# Altium project FROGSBORO.PrjPcb (part 1 of 2)
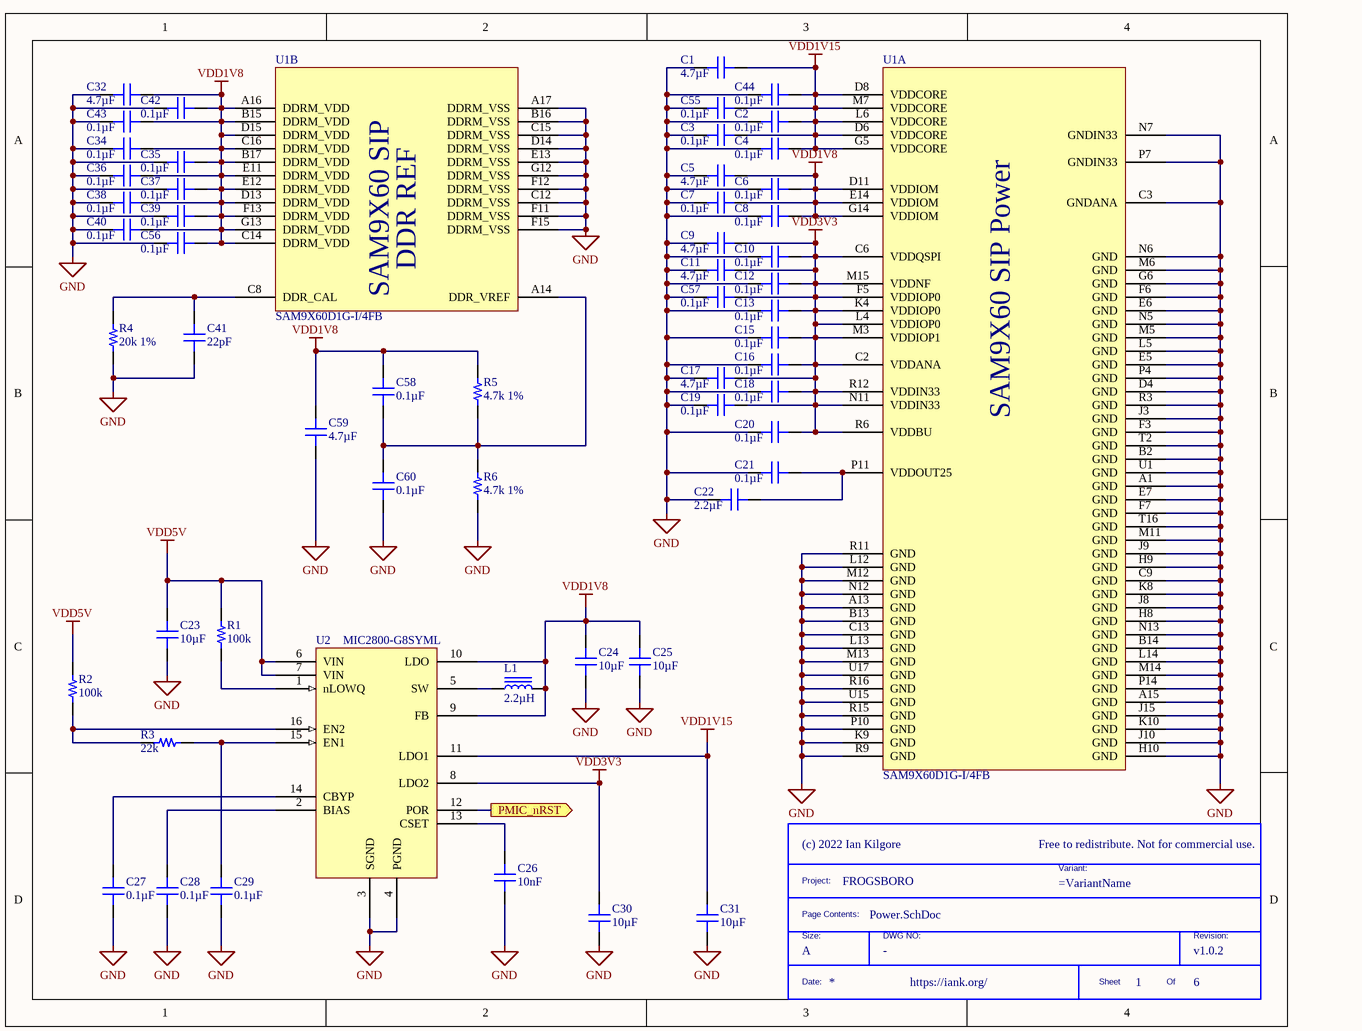
[diagram p0: Power.SchDoc]
VersionRevision: v1.0.2; DesignedByURL: https://iank.org/; Project: FROGSBORO; Company: (c) 2022 Ian Kilgore
6 sheets, 122 parts. Net scope: flat (ports and power ports of the same name join across sheets).
Board file: FROGSBORO.PcbDoc
Sheets:
  Power.SchDoc
  SAM9X60_Core.SchDoc
  SAM9X60_IO.SchDoc
  USB.SchDoc
  SD.SchDoc
  Connectors.SchDoc

## Sheet Power.SchDoc
size A; DocumentNumber: 1; SheetNumber: 1; SheetTotal: 6

### Parts
(Parts that share a designator on the sheet are numbered #1, #2 ... from top to bottom, then left to right.)
*#1  Size: A  (hidden comment: TitleBlock)  (graphical)
C1  4.7µF  [CAP 0402_1005]
C2  0.1µF  [CAP 0402_1005]
C3  0.1µF  [CAP 0402_1005]
C4  0.1µF  [CAP 0402_1005]
C5  4.7µF  [CAP 0402_1005]
C6  0.1µF  [CAP 0402_1005]
C7  0.1µF  [CAP 0402_1005]
C8  0.1µF  [CAP 0402_1005]
C9  4.7µF  [CAP 0402_1005]
C10  0.1µF  [CAP 0402_1005]
C11  4.7µF  [CAP 0402_1005]
C12  0.1µF  [CAP 0402_1005]
C13  0.1µF  [CAP 0402_1005]
C15  0.1µF  [CAP 0402_1005]
C16  0.1µF  [CAP 0402_1005]
C17  4.7µF  [CAP 0402_1005]
C18  0.1µF  [CAP 0402_1005]
C19  0.1µF  [CAP 0402_1005]
C20  0.1µF  [CAP 0402_1005]
C21  0.1µF  [CAP 0402_1005]
C22  2.2µF  [CAP 0402_1005]
C23  10µF  [CAP 0805_2012]
C24  10µF  [CAP 0805_2012]
C25  10µF  [CAP 0805_2012]
C26  10nF  [CAP 0402_1005]
C27  0.1µF  [CAP 0402_1005]
C28  0.1µF  [CAP 0402_1005]
C29  0.1µF  [CAP 0402_1005]
C30  10µF  [CAP 0805_2012]
C31  10µF  [CAP 0805_2012]
C32  4.7µF  [CAP 0402_1005]
C34  0.1µF  [CAP 0402_1005]
C35  0.1µF  [CAP 0402_1005]
C36  0.1µF  [CAP 0402_1005]
C37  0.1µF  [CAP 0402_1005]
C38  0.1µF  [CAP 0402_1005]
C39  0.1µF  [CAP 0402_1005]
C40  0.1µF  [CAP 0402_1005]
C41  22pF  [CAP 0402_1005]
C42  0.1µF  [CAP 0402_1005]
C43  0.1µF  [CAP 0402_1005]
C44  0.1µF  [CAP 0402_1005]
C55  0.1µF  [CAP 0402_1005]
C56  0.1µF  [CAP 0402_1005]
C57  0.1µF  [CAP 0402_1005]
C58  0.1µF  [CAP 0402_1005]
C59  4.7µF  [CAP 0402_1005]
C60  0.1µF  [CAP 0402_1005]
L1  2.2µH  [IND 0806_2016]
R1  100k  [RES 0402_1005]
R2  100k  [RES 0402_1005]
R3  22k  [RES 0402_1005]
R4  20k 1%  [RES 0402_1005]
R5  4.7k 1%  [RES 0402_1005]
R6  4.7k 1%  [RES 0402_1005]
U1  SAM9X60D1G-I/4FB  [BGA233C80P17X17_1400X1400X120]  (parts A,B of 7)
U2  MIC2800-G8SYML  [QFN50P300X300X90-16N]

### Ports
PMIC_nRST (out)

### Nets
GND: C1.1 C2.2 C3.2 C4.2 C5.1 C6.2 C7.2 C8.2 C9.1 C10.2 C11.1 C12.2 C13.2 C15.2 C16.2 C17.1 C18.2 C19.2 C20.2 C21.2 C22.2 C23.1 C24.1 C25.1 C26.1 C27.1 C28.1 C29.1 C30.1 C31.1 C32.1 C34.2 C35.2 C36.2 C37.2 C38.2 C39.2 C40.2 C41.1 C42.2 C43.2 C44.2 C55.2 C56.2 C57.2 C59.1 C60.2 R4.1 R6.1 U1.A1(GND) U1.A13(GND) U1.A15(GND) U1.A17(DDRM_VSS) U1.B2(GND) U1.B13(GND) U1.B14(GND) U1.B16(DDRM_VSS) U1.C3(GNDANA) U1.C9(GND) U1.C12(DDRM_VSS) U1.C13(GND) U1.C15(DDRM_VSS) U1.D4(GND) U1.D14(DDRM_VSS) U1.E5(GND) U1.E6(GND) U1.E7(GND) U1.E13(DDRM_VSS) U1.F3(GND) U1.F6(GND) U1.F7(GND) U1.F11(DDRM_VSS) U1.F12(DDRM_VSS) U1.F15(DDRM_VSS) U1.G6(GND) U1.G12(DDRM_VSS) U1.H8(GND) U1.H9(GND) U1.H10(GND) U1.J3(GND) U1.J8(GND) U1.J9(GND) U1.J10(GND) U1.J15(GND) U1.K8(GND) U1.K9(GND) U1.K10(GND) U1.L5(GND) U1.L12(GND) U1.L13(GND) U1.L14(GND) U1.M5(GND) U1.M6(GND) U1.M11(GND) U1.M12(GND) U1.M13(GND) U1.M14(GND) U1.N5(GND) U1.N6(GND) U1.N7(GNDIN33) U1.N12(GND) U1.N13(GND) U1.P4(GND) U1.P7(GNDIN33) U1.P10(GND) U1.P14(GND) U1.R3(GND) U1.R9(GND) U1.R11(GND) U1.R15(GND) U1.R16(GND) U1.T2(GND) U1.T16(GND) U1.U1(GND) U1.U15(GND) U1.U17(GND) U2.3(SGND) U2.4(PGND)
VDD1V8: C5.2 C6.1 C7.1 C8.1 C24.2 C25.2 C32.2 C34.1 C35.1 C36.1 C37.1 C38.1 C39.1 C40.1 C42.1 C43.1 C56.1 C58.1 C59.2 L1.2 R5.2 U1.A16(DDRM_VDD) U1.B15(DDRM_VDD) U1.B17(DDRM_VDD) U1.C14(DDRM_VDD) U1.C16(DDRM_VDD) U1.D11(VDDIOM) U1.D13(DDRM_VDD) U1.D15(DDRM_VDD) U1.E11(DDRM_VDD) U1.E12(DDRM_VDD) U1.E14(VDDIOM) U1.F13(DDRM_VDD) U1.G13(DDRM_VDD) U1.G14(VDDIOM) U2.9(FB) U2.10(LDO)
VDD1V15: C1.2 C2.1 C3.1 C4.1 C31.2 C44.1 C55.1 U1.D6(VDDCORE) U1.D8(VDDCORE) U1.G5(VDDCORE) U1.L6(VDDCORE) U1.M7(VDDCORE) U2.11(LDO1)
VDD3V3: C9.2 C10.1 C11.2 C12.1 C13.1 C15.1 C16.1 C17.2 C18.1 C19.1 C20.1 C30.2 C57.1 U1.C2(VDDANA) U1.C6(VDDQSPI) U1.F5(VDDIOP0) U1.K4(VDDIOP0) U1.L4(VDDIOP0) U1.M3(VDDIOP1) U1.M15(VDDNF) U1.N11(VDDIN33) U1.R6(VDDBU) U1.R12(VDDIN33) U2.8(LDO2)
VDD5V: C23.2 R1.2 R2.2 U2.6(VIN) U2.7(VIN)
NetC21_1: C21.1 C22.1 U1.P11(VDDOUT25)
NetC26_2: C26.2 U2.13(CSET)
NetC27_2: C27.2 U2.14(CBYP)
NetC28_2: C28.2 U2.2(BIAS)
NetC29_2: C29.2 R3.1 U2.15(EN1)
NetC41_2: C41.2 R4.2 U1.C8(DDR_CAL)
NetC58_2: C58.2 C60.1 R5.1 R6.2 U1.A14(DDR_VREF)
NetL1_1: L1.1 U2.5(SW)
NetR1_1: R1.1 U2.1(nLOWQ)
NetR2_1: R2.1 R3.2 U2.16(EN2)
NetR15_1: U2.12(POR) ; port PMIC_nRST

### Notes on the sheet
- (in symbol SAM9X60D1G-I/4FB, part A) SAM9X60 SIP Power
- (in symbol SAM9X60D1G-I/4FB, part B) DDR REF; SAM9X60 SIP
- (in symbol TitleBlock) Free to redistribute. Not for commercial use.; Project:; Variant:; Page Contents:; Size:; DWG NO:; Revision:; Date:; Sheet; Of

### Library data of the parts
*#1 = TitleBlock: Custom Title Block; DWG: -
C1 C5 C9 C11 C17 C32 C59 = CL05A475KP5NRNC: CAP CER 4.7UF 10V X5R 0402; Manufacturer: Samsung Electro-Mechanics; Tolerance: ±10%; Part Number: CL05A475KP5NRNC; Value: 4.7µF; Applications: General Purpose; Capacitance: 4.7µF; ComponentLink1Description: Datasheet; ComponentLink1URL: http://www.samsungsem.com/kr/support/product-search/mlcc/CL05A475KP5NRNC.jsp; ComponentLink2Description: DigiKey Link; ComponentLink2URL: http://digikey.com/product-detail/en/samsung-electro-mechanics/CL05A475KP5NRNC/1276-1480-1-ND/3889566; Device Package: 0402 (1005 Metric); LastUpdated: 9/2/2020 1:02:23 AM; Lifecycle Status: Active; Minimum Order: 1; Mounting Type: Surface Mount, MLCC; Operating Temperature: -55°C ~ 85°C; Package / Case: 0402 (1005 Metric); Packaging: TapeAndReel; PartId: 2191; Part Status: Active; Price: 0.08; Series: CL; Size / Dimension: 0.039" L x 0.020" W (1.00mm x 0.50mm); Supplier 1: DigiKey; Supplier Part Number 1: 1276-1480-1-ND; Temperature Coefficient: X5R; Thickness (Max): 0.022" (0.55mm); Voltage - Rated: 10V
C2-C4 C6-C8 C10 C12 C13 C15 C16 C18-C21 C27-C29 C34-C40 C42-C44 C55-C58 C60 = C0402C104K4PACTU: CAP CER 0.1UF 16V X5R 0402; Manufacturer: KEMET; Tolerance: ±10%; Part Number: C0402C104K4PACTU; Value: 0.1µF; Applications: General Purpose; Capacitance: 0.1µF; ComponentLink1Description: Datasheet; ComponentLink1URL: https://api.kemet.com/component-edge/download/datasheet/C0402C104K4PACTU.pdf; ComponentLink2Description: DigiKey Link; ComponentLink2URL: http://digikey.com/product-detail/en/kemet/C0402C104K4PACTU/399-7762-1-ND/3471485; Device Package: 0402 (1005 Metric); LastUpdated: 9/2/2020 1:02:03 AM; Lifecycle Status: Active; Minimum Order: 1; Mounting Type: Surface Mount, MLCC; Operating Temperature: -55°C ~ 85°C; Package / Case: 0402 (1005 Metric); Packaging: TapeAndReel; PartId: 11334; Part Status: Active; Price: 0.01; Series: SMD Comm X5R; Size / Dimension: 0.039" L x 0.020" W (1.00mm x 0.50mm); Supplier 1: DigiKey; Supplier Part Number 1: 399-7762-1-ND; Temperature Coefficient: X5R; Thickness (Max): 0.022" (0.55mm); Voltage - Rated: 16V
C22 = C1005X5R1A225K050BC: CAP CER 2.2UF 10V X5R 0402; Manufacturer: TDK Corporation; Tolerance: ±10%; Part Number: C1005X5R1A225K050BC; Value: 2.2µF; Applications: General Purpose; Capacitance: 2.2µF; ComponentLink1Description: Datasheet; ComponentLink1URL: https://product.tdk.com/info/en/catalog/datasheets/mlcc_commercial_general_en.pdf?ref_disty=digikey; ComponentLink2Description: DigiKey Link; ComponentLink2URL: http://digikey.com/product-detail/en/tdk-corporation/C1005X5R1A225K050BC/445-7392-1-ND/2733464; Device Package: 0402 (1005 Metric); Features: Low ESL; LastUpdated: 9/2/2020 1:02:23 AM; Lifecycle Status: Active; Minimum Order: 1; Mounting Type: Surface Mount, MLCC; Operating Temperature: -55°C ~ 85°C; Package / Case: 0402 (1005 Metric); Packaging: TapeAndReel; PartId: 2144; Part Status: Active; Price: 0.07; Series: C; Size / Dimension: 0.039" L x 0.020" W (1.00mm x 0.50mm); Supplier 1: DigiKey; Supplier Part Number 1: 445-7392-1-ND; Temperature Coefficient: X5R; Thickness (Max): 0.022" (0.55mm); Voltage - Rated: 10V
C23-C25 C30 C31 = CL21A106KPCLQNC: CAP CER 10UF 10V X5R 0805; Manufacturer: Samsung Electro-Mechanics; Tolerance: ±10%; Part Number: CL21A106KPCLQNC; Value: 10µF; Applications: General Purpose; Capacitance: 10µF; ComponentLink1Description: Datasheet; ComponentLink1URL: http://www.samsungsem.com/kr/support/product-search/mlcc/CL21A106KPCLQNC.jsp; ComponentLink2Description: DigiKey Link; ComponentLink2URL: http://digikey.com/product-detail/en/samsung-electro-mechanics/CL21A106KPCLQNC/1276-2402-1-ND/3890488; Device Package: 0805 (2012 Metric); LastUpdated: 9/2/2020 1:04:19 AM; Lifecycle Status: Active; Minimum Order: 1; Mounting Type: Surface Mount, MLCC; Operating Temperature: -55°C ~ 85°C; Package / Case: 0805 (2012 Metric); Packaging: TapeAndReel; PartId: 14319; Part Status: Active; Price: 0.03; Series: CL; Size / Dimension: 0.079" L x 0.049" W (2.00mm x 1.25mm); Supplier 1: DigiKey; Supplier Part Number 1: 1276-2402-1-ND; Temperature Coefficient: X5R; Thickness (Max): 0.037" (0.95mm); Voltage - Rated: 10V
C26 = C0402C103K4RECAUTO: CAP CER 0402 10NF 16V X7R 10%; Manufacturer: KEMET; Capacitance: 10000pF; Part Number: C0402C103K4RECAUTO; Value: 10nF; Applications: Automotive, ESD Protection; ComponentLink1Description: Datasheet; ComponentLink1URL: https://api.kemet.com/component-edge/download/datasheet/C0402C103K4RECAUTO.pdf; ComponentLink2Description: DigiKey Link; ComponentLink2URL: http://digikey.com/product-detail/en/kemet/C0402C103K4RECAUTO/399-17876-1-ND/8640543; Device Package: 0402 (1005 Metric); LastUpdated: 9/2/2020 1:02:25 AM; Lifecycle Status: Active; Minimum Order: 1; Mounting Type: Surface Mount, MLCC; Operating Temperature: -55°C ~ 125°C; Package / Case: 0402 (1005 Metric); Packaging: TapeAndReel; PartId: 1725; Part Status: Active; Price: 0.02; Ratings: AEC-Q200; Series: ESD SMD Auto X7R; Size / Dimension: 0.039" L x 0.020" W (1.00mm x 0.50mm); Supplier 1: DigiKey; Supplier Part Number 1: 399-17876-1-ND; Temperature Coefficient: X7R; Thickness (Max): 0.022" (0.55mm); Tolerance: ±10%; Voltage - Rated: 16V
C41 = 0402N220F500CT: CAP CER 22PF 50V C0G/NP0 0402; Manufacturer: Walsin Technology Corporation; Temperature Coefficient: C0G, NP0; Tolerance: ±1%; Part Number: 0402N220F500CT; Value: 22pF; Applications: General Purpose; Capacitance: 22pF; ComponentLink1Description: Datasheet; ComponentLink1URL: http://www.passivecomponent.com/wp-content/uploads/2018/10/MLCC.pdf; ComponentLink2Description: DigiKey Link; ComponentLink2URL: http://digikey.com/product-detail/en/walsin-technology-corporation/0402N220F500CT/1292-1280-1-ND/9355284; Device Package: 0402 (1005 Metric); LastUpdated: 9/2/2020 1:02:14 AM; Lifecycle Status: Active; Minimum Order: 1; Mounting Type: Surface Mount, MLCC; Operating Temperature: -55°C ~ 125°C; Package / Case: 0402 (1005 Metric); Packaging: TapeAndReel; PartId: 6200; Part Status: Active; Price: 0.01; Series: -; Size / Dimension: 0.039" L x 0.020" W (1.00mm x 0.50mm); Supplier 1: DigiKey; Supplier Part Number 1: 1292-1280-1-ND; Thickness (Max): 0.022" (0.55mm); Voltage - Rated: 50V
L1 = CIGT201610EH2R2MNE: FIXED IND 2.2UH 2.5A 87MOHM SMD; Manufacturer: Samsung Electro-Mechanics; Current - Saturation: 2.9A; DC Resistance (DCR): 87mOhm Max; Inductance Frequency - Test: 1MHz; Material - Core: Metal Composite; Shielding: Unshielded; Tolerance: ±20%; Type: Thin Film; Part Number: CIGT201610EH2R2MNE; ComponentLink1Description: Datasheet; ComponentLink1URL: http://www.samsungsem.com/kr/support/product-search/inductor/CIGT201610EH2R2MNE.jsp; ComponentLink2Description: DigiKey Link; ComponentLink2URL: http://digikey.com/product-detail/en/samsung-electro-mechanics/CIGT201610EH2R2MNE/1276-6901-1-ND/7041301; Current Rating (Amps): 2.5A; Device Package: 0806 (2016 Metric); Height - Seated (Max): 0.039" (1.00mm); Inductance: 2.2µH; LastUpdated: 9/2/2020 1:24:36 AM; Lifecycle Status: Active; Minimum Order: 1; Mounting Type: Surface Mount; Operating Temperature: -40°C ~ 125°C; Package / Case: 0806 (2016 Metric); Packaging: TapeAndReel; PartId: 3766; Part Status: Active; Price: 0.11; Series: CIGT; Size / Dimension: 0.079" L x 0.063" W (2.00mm x 1.60mm); Supplier 1: DigiKey; Supplier Part Number 1: 1276-6901-1-ND; Supplier Device Package: 0806 (2016 Metric); Value: 2.2µH
R1 R2 = CRCW0402100KFKEDC: RES SMD 100K OHM 1% 1/16W 0402; Manufacturer: Vishay Dale; Power (Watts): 0.063W, 1/16W; Resistance: 100 kOhms; Temperature Coefficient: ±100ppm/°C; Part Number: CRCW0402100KFKEDC; Value: 100k; ComponentLink1Description: Datasheet; ComponentLink1URL: http://www.vishay.com/docs/28773/crcwce3.pdf; ComponentLink2Description: DigiKey Link; ComponentLink2URL: http://digikey.com/product-detail/en/vishay-dale/CRCW0402100KFKEDC/541-3960-1-ND/7928643; Composition: Thick Film; Device Package: 0402 (1005 Metric); Height - Seated (Max): 0.014" (0.35mm); LastUpdated: 9/2/2020 1:07:49 AM; Lifecycle Status: Active; Minimum Order: 1; Number of Terminations: 2; Operating Temperature: -55°C ~ 155°C; Package / Case: 0402 (1005 Metric); Packaging: CutTape; PartId: 12665; Part Status: Active; Price: 0.10; Series: CRCW-C; Size / Dimension: 0.039" L x 0.020" W (1.00mm x 0.50mm); Supplier 1: DigiKey; Supplier Part Number 1: 541-3960-1-ND; Supplier Device Package: 0402; Tolerance: ±1%
R3 = CR0402-FX-2202GLF: RES SMD 22K OHM 1% 1/16W 0402; Manufacturer: Bourns Inc.; Power (Watts): 0.063W, 1/16W; Resistance: 22 kOhms; Temperature Coefficient: ±100ppm/°C; Part Number: CR0402-FX-2202GLF; Value: 22k; ComponentLink1Description: Datasheet; ComponentLink1URL: https://www.bourns.com/docs/Product-Datasheets/CR0402.pdf; ComponentLink2Description: DigiKey Link; ComponentLink2URL: http://digikey.com/product-detail/en/bourns-inc/CR0402-FX-2202GLF/CR0402-FX-2202GLFCT-ND/4247665; Composition: Thick Film; Device Package: 0402 (1005 Metric); Height - Seated (Max): 0.016" (0.40mm); LastUpdated: 9/2/2020 1:08:01 AM; Lifecycle Status: Active; Minimum Order: 1; Number of Terminations: 2; Operating Temperature: -55°C ~ 155°C; Package / Case: 0402 (1005 Metric); Packaging: CutTape; PartId: 6638; Part Status: Active; Price: 0.10; Series: CR0402; Size / Dimension: 0.039" L x 0.020" W (1.00mm x 0.50mm); Supplier 1: DigiKey; Supplier Part Number 1: CR0402-FX-2202GLFCT-ND; Supplier Device Package: 0402; Tolerance: ±1%
R4 = CR0402-FX-2002GLF: RES SMD 20K OHM 1% 1/16W 0402; Manufacturer: Bourns Inc.; Power (Watts): 0.063W, 1/16W; Resistance: 20 kOhms; Temperature Coefficient: ±100ppm/°C; Part Number: CR0402-FX-2002GLF; Value: 20k 1%; ComponentLink1Description: Datasheet; ComponentLink1URL: https://www.bourns.com/docs/Product-Datasheets/CR0402.pdf; ComponentLink2Description: DigiKey Link; ComponentLink2URL: http://digikey.com/product-detail/en/bourns-inc/CR0402-FX-2002GLF/CR0402-FX-2002GLFCT-ND/3740845; Composition: Thick Film; Device Package: 0402 (1005 Metric); Height - Seated (Max): 0.016" (0.40mm); LastUpdated: 9/2/2020 1:08:01 AM; Lifecycle Status: Active; Minimum Order: 1; Number of Terminations: 2; Operating Temperature: -55°C ~ 155°C; Package / Case: 0402 (1005 Metric); Packaging: CutTape; PartId: 6612; Part Status: Active; Price: 0.10; Series: CR0402; Size / Dimension: 0.039" L x 0.020" W (1.00mm x 0.50mm); Supplier 1: DigiKey; Supplier Part Number 1: CR0402-FX-2002GLFCT-ND; Supplier Device Package: 0402; Tolerance: ±1%
R5 R6 = CR0402-FX-4701GLF: RES SMD 4.7K OHM 1% 1/16W 0402; Manufacturer: Bourns Inc.; Power (Watts): 0.063W, 1/16W; Resistance: 4.7 kOhms; Temperature Coefficient: ±100ppm/°C; Part Number: CR0402-FX-4701GLF; Value: 4.7k 1%; ComponentLink1Description: Datasheet; ComponentLink1URL: https://www.bourns.com/docs/Product-Datasheets/CR0402.pdf; ComponentLink2Description: DigiKey Link; ComponentLink2URL: http://digikey.com/product-detail/en/bourns-inc/CR0402-FX-4701GLF/CR0402-FX-4701GLFCT-ND/3740849; Composition: Thick Film; Device Package: 0402 (1005 Metric); Height - Seated (Max): 0.016" (0.40mm); LastUpdated: 9/2/2020 1:08:01 AM; Lifecycle Status: Active; Minimum Order: 1; Number of Terminations: 2; Operating Temperature: -55°C ~ 155°C; Package / Case: 0402 (1005 Metric); Packaging: CutTape; PartId: 6504; Part Status: Active; Price: 0.10; Series: CR0402; Size / Dimension: 0.039" L x 0.020" W (1.00mm x 0.50mm); Supplier 1: DigiKey; Supplier Part Number 1: CR0402-FX-4701GLFCT-ND; Supplier Device Package: 0402; Tolerance: ±1%
U1 = SAM9X60D1G-I/4FB: ARM926 MPU, 1GBIT DDR2, BGA, IND TEMP; Manufacturer: Microchip; Manufacturer Part Number: SAM9X60D6K-I/4GB; Supplier 1: Digi-Key; RoHS: No; Category: Microprocessors; Stock 1: 237; Pricing 1: 1=10.63000, 25=9.74040, 100=8.82060 (USD); Supplier Part Number 1: 150-SAM9X60D6K-I/4GB-ND
U2 = MIC2800-G8SYML-TR: DC-DC + 2 Linear Regulators with LowQ Mode & POR 16 VQFN 3x3x0.90mm T/R RoHS Compliant: Yes; Manufacturer: Microchip; Supplier 1: Digi-Key; Manufacturer Part Number: MIC2800-G8SYML-TR; RoHS: Yes; Category: Power Management ICs; Stock 1: 5000; Pricing 1: 5000=1.90500 (USD); Supplier Part Number 1: MIC2800-G8SYML-TR-ND

## Sheet SAM9X60_Core.SchDoc
size A; DocumentNumber: 2; SheetNumber: 2; SheetTotal: 6
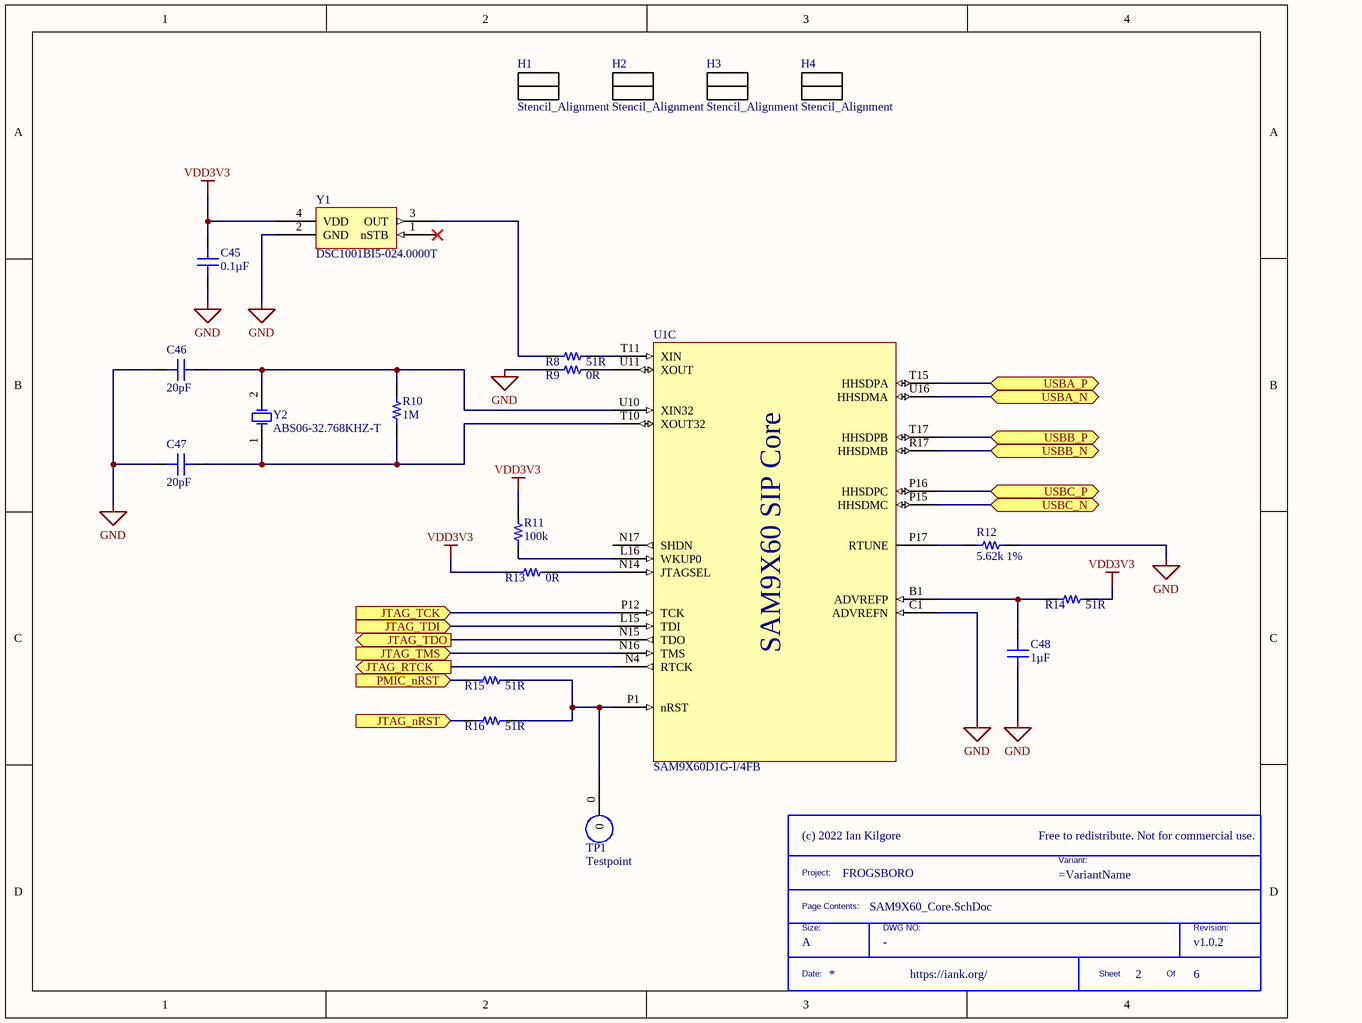
[diagram p1: SAM9X60_Core.SchDoc]

### Parts
(Parts that share a designator on the sheet are numbered #1, #2 ... from top to bottom, then left to right.)
*#2  Size: A  (hidden comment: TitleBlock)  (graphical)
C45  0.1µF  [CAP 0402_1005]
C46  20pF  [CAP 0402_1005]
C47  20pF  [CAP 0402_1005]
C48  1µF  [CAP 0402_1005]
H1  Stencil_Alignment  [Stencil_Alignment]
H2  Stencil_Alignment  [Stencil_Alignment]
H3  Stencil_Alignment  [Stencil_Alignment]
H4  Stencil_Alignment  [Stencil_Alignment]
R8  51R  [RES 0402_1005]
R9  0R  [RES 0402_1005]
R10  1M  [RES 0402_1005]
R11  100k  [RES 0402_1005]
R12  5.62k 1%  [RES 0402_1005]
R13  0R  [RES 0402_1005]
R14  51R  [RES 0402_1005]
R15  51R  [RES 0402_1005]
R16  51R  [RES 0402_1005]
TP1  Testpoint  [Testpoint]  (no BOM)
U1  SAM9X60D1G-I/4FB  [BGA233C80P17X17_1400X1400X120]  (part C of 7)
Y1  DSC1001BI5-024.0000T  [DSC1001BI5]
Y2  ABS06-32.768KHZ-T  [ABRA-ABS06-2_V]

### Ports
JTAG_nRST (in), JTAG_RTCK (out), JTAG_TCK (in), JTAG_TDI (in), JTAG_TDO (out), JTAG_TMS (in), PMIC_nRST (in), USBA_N (bidir), USBA_P (bidir), USBB_N (bidir), USBB_P (bidir), USBC_N (bidir), USBC_P (bidir)

### Nets
GND: C45.2 C46.1 C47.1 C48.1 R9.1 R12.2 U1.C1(ADVREFN) Y1.2(GND)
VDD3V3: C45.1 R11.2 R13.1 R14.2 Y1.4(VDD)
USBA_N: U1.U16(HHSDMA) ; port USBA_N
USBA_P: U1.T15(HHSDPA) ; port USBA_P
USBB_N: U1.R17(HHSDMB) ; port USBB_N
USBB_P: U1.T17(HHSDPB) ; port USBB_P
USBC_N: U1.P15(HHSDMC) ; port USBC_N
USBC_P: U1.P16(HHSDPC) ; port USBC_P
NetC46_2: C46.2 R10.2 U1.U10(XIN32) Y2.2(X2)
NetC47_2: C47.2 R10.1 U1.T10(XOUT32) Y2.1(X1)
NetC48_2: C48.2 R14.1 U1.B1(ADVREFP)
NetJ7_2: U1.N16(TMS) ; port JTAG_TMS
NetJ7_4: U1.P12(TCK) ; port JTAG_TCK
NetJ7_6: U1.N15(TDO) ; port JTAG_TDO
NetJ7_8: U1.L15(TDI) ; port JTAG_TDI
NetJ7_10: R16.1 ; port JTAG_nRST
NetR8_1: R8.1 Y1.3(OUT)
NetR8_2: R8.2 U1.T11(XIN)
NetR9_2: R9.2 U1.U11(XOUT)
NetR11_1: R11.1 U1.L16(WKUP0)
NetR12_1: R12.1 U1.P17(RTUNE)
NetR13_2: R13.2 U1.N14(JTAGSEL)
NetR15_1: R15.1 ; port PMIC_nRST
NetR15_2: R15.2 R16.2 TP1.0 U1.P1(nRST)
NetR27_1: U1.N4(RTCK) ; port JTAG_RTCK

Not connected (* = marked no-connect by the designer): H1 0; H2 0; H3 0; H4 0; U1 N17(SHDN); Y1 1(nSTB)*

### Notes on the sheet
- (in symbol SAM9X60D1G-I/4FB, part C) SAM9X60 SIP Core
- (in symbol TitleBlock) Free to redistribute. Not for commercial use.; Project:; Variant:; Page Contents:; Size:; DWG NO:; Revision:; Date:; Sheet; Of

### Library data of the parts
*#2 = TitleBlock: Custom Title Block; DWG: -
C45 = C0402C104K4PACTU: as C2 on sheet Power; Part Number: C0402C104K4PACTU; Value: 0.1µF; Applications: General Purpose; Capacitance: 0.1µF; ComponentLink1Description: Datasheet; ComponentLink1URL: https://api.kemet.com/component-edge/download/datasheet/C0402C104K4PACTU.pdf; ComponentLink2Description: DigiKey Link; ComponentLink2URL: http://digikey.com/product-detail/en/kemet/C0402C104K4PACTU/399-7762-1-ND/3471485; Device Package: 0402 (1005 Metric); LastUpdated: 9/2/2020 1:02:03 AM; Lifecycle Status: Active; Minimum Order: 1; Mounting Type: Surface Mount, MLCC; Operating Temperature: -55°C ~ 85°C; Package / Case: 0402 (1005 Metric); Packaging: TapeAndReel; PartId: 11334; Part Status: Active; Price: 0.01; Series: SMD Comm X5R; Size / Dimension: 0.039" L x 0.020" W (1.00mm x 0.50mm); Supplier 1: DigiKey; Supplier Part Number 1: 399-7762-1-ND; Temperature Coefficient: X5R; Thickness (Max): 0.022" (0.55mm); Voltage - Rated: 16V
C46 C47 = GJM1555C1H200FB01D: CAP CER 20PF 50V C0G/NP0 0402; Manufacturer: Murata Electronics; Temperature Coefficient: C0G, NP0; Tolerance: ±1%; Part Number: GJM1555C1H200FB01D; Value: 20pF; Applications: RF, Microwave, High Frequency; Capacitance: 20pF; ComponentLink1Description: Datasheet; ComponentLink1URL: https://search.murata.co.jp/Ceramy/image/img/A01X/G101/ENG/GJM1555C1H200FB01-01.pdf; ComponentLink2Description: DigiKey Link; ComponentLink2URL: http://digikey.com/product-detail/en/murata-electronics/GJM1555C1H200FB01D/490-11204-1-ND/5333044; Device Package: 0402 (1005 Metric); Features: High Q, Low Loss; LastUpdated: 9/2/2020 1:02:17 AM; Lifecycle Status: Active; Minimum Order: 1; Mounting Type: Surface Mount, MLCC; Operating Temperature: -55°C ~ 125°C; Package / Case: 0402 (1005 Metric); Packaging: TapeAndReel; PartId: 4905; Part Status: Active; Price: 0.04; Series: GJM; Size / Dimension: 0.039" L x 0.020" W (1.00mm x 0.50mm); Supplier 1: DigiKey; Supplier Part Number 1: 490-11204-1-ND; Thickness (Max): 0.022" (0.55mm); Voltage - Rated: 50V
C48 = 0402ZD105KAT2A: CAP CER 1UF 10V X5R 0402; Manufacturer: AVX Corporation; Tolerance: ±10%; Part Number: 0402ZD105KAT2A; Value: 1µF; Applications: General Purpose; Capacitance: 1µF; ComponentLink1Description: Datasheet; ComponentLink1URL: http://datasheets.avx.com/cx5r.pdf; ComponentLink2Description: DigiKey Link; ComponentLink2URL: http://digikey.com/product-detail/en/avx-corporation/0402ZD105KAT2A/478-4596-1-ND/1645907; Device Package: 0402 (1005 Metric); LastUpdated: 9/2/2020 1:02:11 AM; Lifecycle Status: Active; Minimum Order: 1; Mounting Type: Surface Mount, MLCC; Operating Temperature: -55°C ~ 85°C; Package / Case: 0402 (1005 Metric); Packaging: TapeAndReel; PartId: 7596; Part Status: Active; Price: 0.03; Series: -; Size / Dimension: 0.039" L x 0.020" W (1.00mm x 0.50mm); Supplier 1: DigiKey; Supplier Part Number 1: 478-4596-1-ND; Temperature Coefficient: X5R; Thickness (Max): 0.022" (0.56mm); Voltage - Rated: 10V
R8 R14-R16 = AC0402FR-0751RL: RES SMD 51 OHM 1% 1/16W 0402; Manufacturer: Yageo; Power (Watts): 0.063W, 1/16W; Resistance: 51 Ohms; Temperature Coefficient: ±100ppm/°C; Part Number: AC0402FR-0751RL; Value: 51R; ComponentLink1Description: Datasheet; ComponentLink1URL: https://www.yageo.com/upload/media/product/productsearch/datasheet/rchip/PYu-AC_51_RoHS_L_7.pdf; ComponentLink2Description: DigiKey Link; ComponentLink2URL: http://digikey.com/product-detail/en/yageo/AC0402FR-0751RL/YAG3500CT-ND/6006349; Composition: Thick Film; Device Package: 0402 (1005 Metric); Features: Automotive AEC-Q200, Moisture Resistant; Height - Seated (Max): 0.015" (0.37mm); LastUpdated: 9/2/2020 1:07:50 AM; Lifecycle Status: Active; Minimum Order: 1; Number of Terminations: 2; Operating Temperature: -55°C ~ 155°C; Package / Case: 0402 (1005 Metric); Packaging: CutTape; PartId: 12070; Part Status: Active; Price: 0.10; Ratings: AEC-Q200; Series: AC; Size / Dimension: 0.039" L x 0.020" W (1.00mm x 0.50mm); Supplier 1: DigiKey; Supplier Part Number 1: YAG3500CT-ND; Supplier Device Package: 0402; Tolerance: ±1%
R9 R13 = CRG0402ZR: RES SMD 0 OHM JUMPER 1/16W 0402; Manufacturer: TE Connectivity Passive Product; Power (Watts): 0.063W, 1/16W; Part Number: CRG0402ZR; ComponentLink1Description: Datasheet; ComponentLink1URL: https://www.te.com/commerce/DocumentDelivery/DDEController?Action=srchrtrv&DocNm=1773204&DocType=DS&DocLang=English; ComponentLink2Description: DigiKey Link; ComponentLink2URL: http://digikey.com/product-detail/en/te-connectivity-passive-product/CRG0402ZR/A106025CT-ND/3477649; Composition: Thick Film; Device Package: 0402 (1005 Metric); Height - Seated (Max): 0.016" (0.40mm); LastUpdated: 9/2/2020 1:07:28 AM; Lifecycle Status: Active; Minimum Order: 1; Number of Terminations: 2; Operating Temperature: -55°C ~ 155°C; Package / Case: 0402 (1005 Metric); Packaging: CutTape; PartId: 20614; Part Status: Active; Price: 0.10; Series: CRG, Neohm; Size / Dimension: 0.039" L x 0.020" W (1.00mm x 0.50mm); Supplier 1: DigiKey; Supplier Part Number 1: A106025CT-ND; Supplier Device Package: 0402; Tolerance: Jumper; Value: 0R
R10 = RCS04021M00JNED: RES SMD 1M OHM 5% 1/5W 0402; Manufacturer: Vishay Dale; Power (Watts): 0.2W, 1/5W; Resistance: 1 MOhms; Temperature Coefficient: ±200ppm/°C; Part Number: RCS04021M00JNED; Value: 1M; ComponentLink1Description: Datasheet; ComponentLink1URL: http://www.vishay.com/docs/20065/rcse3.pdf; ComponentLink2Description: DigiKey Link; ComponentLink2URL: http://digikey.com/product-detail/en/vishay-dale/RCS04021M00JNED/541-2922-1-ND/5867215; Composition: Thick Film; Device Package: 0402 (1005 Metric); Features: Automotive AEC-Q200, Pulse Withstanding; Height - Seated (Max): 0.016" (0.40mm); LastUpdated: 9/2/2020 1:08:03 AM; Lifecycle Status: Active; Minimum Order: 1; Number of Terminations: 2; Operating Temperature: -55°C ~ 155°C; Package / Case: 0402 (1005 Metric); Packaging: TapeAndReel; PartId: 5540; Part Status: Active; Price: 0.01; Ratings: AEC-Q200; Series: RCS e3; Size / Dimension: 0.039" L x 0.020" W (1.00mm x 0.50mm); Supplier 1: DigiKey; Supplier Part Number 1: 541-2922-1-ND; Supplier Device Package: 0402; Tolerance: ±5%
R11 = CRCW0402100KFKEDC: as R1 on sheet Power; Part Number: CRCW0402100KFKEDC; Value: 100k; ComponentLink1Description: Datasheet; ComponentLink1URL: http://www.vishay.com/docs/28773/crcwce3.pdf; ComponentLink2Description: DigiKey Link; ComponentLink2URL: http://digikey.com/product-detail/en/vishay-dale/CRCW0402100KFKEDC/541-3960-1-ND/7928643; Composition: Thick Film; Device Package: 0402 (1005 Metric); Height - Seated (Max): 0.014" (0.35mm); LastUpdated: 9/2/2020 1:07:49 AM; Lifecycle Status: Active; Minimum Order: 1; Number of Terminations: 2; Operating Temperature: -55°C ~ 155°C; Package / Case: 0402 (1005 Metric); Packaging: CutTape; PartId: 12665; Part Status: Active; Price: 0.10; Series: CRCW-C; Size / Dimension: 0.039" L x 0.020" W (1.00mm x 0.50mm); Supplier 1: DigiKey; Supplier Part Number 1: 541-3960-1-ND; Supplier Device Package: 0402; Tolerance: ±1%
R12 = AC0402FR-075K62L: RES SMD 5.62K OHM 1% 1/16W 0402; Manufacturer: Yageo; Power (Watts): 0.063W, 1/16W; Resistance: 5.62 kOhms; Temperature Coefficient: ±100ppm/°C; Part Number: AC0402FR-075K62L; Value: 5.62k 1%; ComponentLink1Description: Datasheet; ComponentLink1URL: https://www.yageo.com/upload/media/product/productsearch/datasheet/rchip/PYu-AC_51_RoHS_L_7.pdf; ComponentLink2Description: DigiKey Link; ComponentLink2URL: http://digikey.com/product-detail/en/yageo/AC0402FR-075K62L/YAG5303CT-ND/7063646; Composition: Thick Film; Device Package: 0402 (1005 Metric); Features: Automotive AEC-Q200, Moisture Resistant; Height - Seated (Max): 0.015" (0.37mm); LastUpdated: 9/2/2020 1:08:04 AM; Lifecycle Status: Active; Minimum Order: 1; Number of Terminations: 2; Operating Temperature: -55°C ~ 155°C; Package / Case: 0402 (1005 Metric); Packaging: CutTape; PartId: 5233; Part Status: Active; Price: 0.10; Ratings: AEC-Q200; Series: AC; Size / Dimension: 0.039" L x 0.020" W (1.00mm x 0.50mm); Supplier 1: DigiKey; Supplier Part Number 1: YAG5303CT-ND; Supplier Device Package: 0402; Tolerance: ±1%
U1 = SAM9X60D1G-I/4FB: as U1 on sheet Power; Supplier 1: Digi-Key; RoHS: No; Category: Microprocessors; Stock 1: 237; Pricing 1: 1=10.63000, 25=9.74040, 100=8.82060 (USD); Supplier Part Number 1: 150-SAM9X60D6K-I/4GB-ND
Y1 = DSC1001BI5-024.0000T: Low-Power Precision CMOS Oscillator 24MHz 1.7V to 3.6V 10ppm 4-Pin Surface Mount T/R; Manufacturer: Microchip; Operating Supply Voltage: 3.3V; Load Capacitance: 15pF; Max Supply Current: 6.3mA; Max Duty Cycle: 55%; Supplier 1: Digi-Key; Manufacturer Part Number: DSC1001BI5-024.0000T; RoHS: Yes; Category: Timers and Oscillators; Pricing 1: 1000=1.95000 (USD); Mount: Surface Mount; Case/Package: SMD/SMT; Min Operating Temperature: -40°C; Max Operating Temperature: 85°C; Frequency: 24MHz; Packaging: Tape and Reel; Package Quantity: 1000; Max Supply Voltage: 3.6V; Min Supply Voltage: 1.7V; Frequency Stability: 10ppm; Termination: Solder; Length: 0.197inch; Width: 0.126inch; Height: 0.035inch; Ratings: AEC-Q100; ComponentLink1URL: http://www.mouser.com/ds/2/268/DSC1001_Datasheet-775857.pdf?src-supplier=Mouser; ComponentLink1Description: http://www.mouser.com/ds/2/268/DSC1001_Datasheet-775857.pdf?src-supplier=Mouser; ComponentLink2URL: http://www.microchip.com/mymicrochip/filehandler.aspx?ddocname=en576698&src-supplier=Digi-Key; ComponentLink2Description: http://www.microchip.com/mymicrochip/filehandler.aspx?ddocname=en576698&src-supplier=Digi-Key; Supplier Part Number 1: DSC1001BI5-024.0000T-ND
Y2 = CMP-2000-05035-1: Low Profile Crystal, 32.768 KHz, -40 to 85 degC, 2-Pin SMD, RoHS, Tape and Reel; Brand: ABRACON; Tolerance: 20PPM; Case Height: 0.6mm; Case Length: 2mm; Case Width: 1.2mm; ESR: 90kOhms; Load Capacitance: 12.5pF; Series: ABS06; Manufacturer URL: http://www.abracon.com/; RoHS: Details; Datasheet URL: http://www.mouser.com/ds/2/3/ABS06-10798.pdf; Package / Case: 2-SMD; Mounting Style: SMD/SMT; Type: LowProfileCrystal; Product Category: Crystals; Datasheet Version: Sep-15; Frequency Stability: 20PPM; Packaging: Reel; Frequency: 32.768kHz; Operating Temperature Range: -40Cto+85C; Package Description: 2-Pin Surface Mounted Device, Body 2 x 1.2 mm, Height 0.6 mm; Dimensions: 1.2mmWx2mmLx0.6mmH; Package Reference: ABS06; Manufacturer: ABRACON; Termination Style: SMD/SMT; Factory Pack Quantity: 3000

## Sheet SAM9X60_IO.SchDoc
size A; DocumentNumber: 3; SheetNumber: 3; SheetTotal: 6
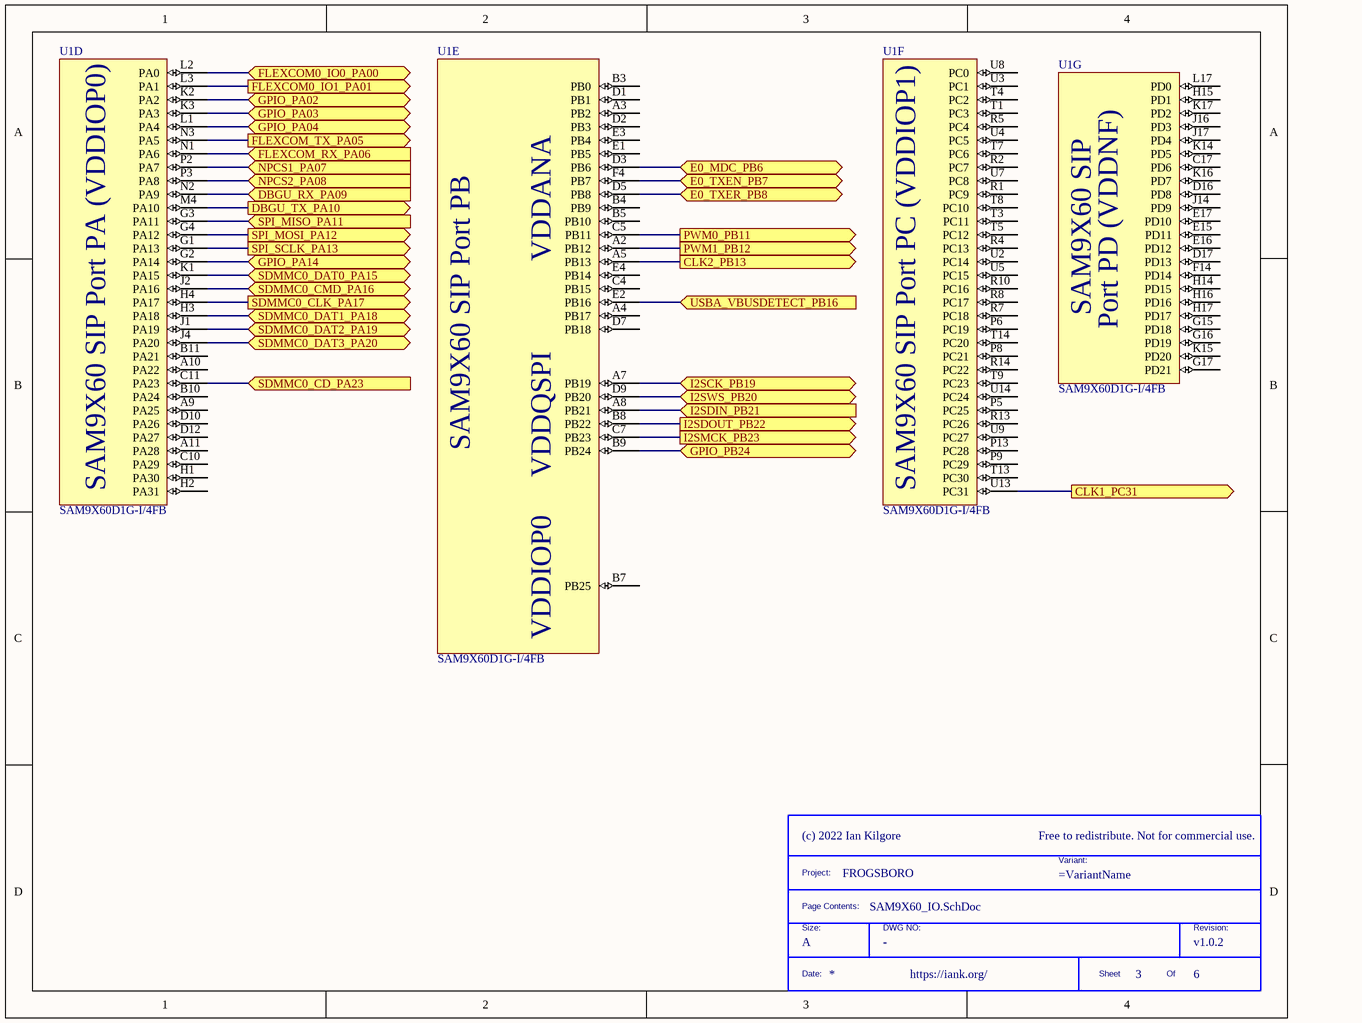
[diagram p2: SAM9X60_IO.SchDoc]

### Parts
(Parts that share a designator on the sheet are numbered #1, #2 ... from top to bottom, then left to right.)
*#3  Size: A  (hidden comment: TitleBlock)  (graphical)
U1  SAM9X60D1G-I/4FB  [BGA233C80P17X17_1400X1400X120]  (parts D,E,F,G of 7)

### Ports
CLK1_PC31 (out), CLK2_PB13 (out), DBGU_RX_PA09 (in), DBGU_TX_PA10 (out), E0_MDC_PB6 (bidir), E0_TXEN_PB7 (bidir), E0_TXER_PB8 (bidir), FLEXCOM0_IO0_PA00 (bidir), FLEXCOM0_IO1_PA01 (out), FLEXCOM_RX_PA06 (in), FLEXCOM_TX_PA05 (out), GPIO_PA02 (bidir), GPIO_PA03 (bidir), GPIO_PA04 (bidir), GPIO_PA14 (bidir), GPIO_PB24 (bidir), I2SCK_PB19 (bidir), I2SDIN_PB21 (in), I2SDOUT_PB22 (out), I2SMCK_PB23 (out), I2SWS_PB20 (bidir), NPCS1_PA07 (in), NPCS2_PA08 (in), PWM0_PB11 (out), PWM1_PB12 (out), SDMMC0_CD_PA23 (in), SDMMC0_CLK_PA17 (out), SDMMC0_CMD_PA16 (bidir), SDMMC0_DAT0_PA15 (bidir), SDMMC0_DAT1_PA18 (bidir), SDMMC0_DAT2_PA19 (bidir), SDMMC0_DAT3_PA20 (bidir), SPI_MISO_PA11 (in), SPI_MOSI_PA12 (out), SPI_SCLK_PA13 (out), USBA_VBUSDETECT_PB16 (in)

### Nets
NetJ4_9: U1.C11(PA23) ; port SDMMC0_CD_PA23
NetJ5_3: U1.L2(PA0) ; port FLEXCOM0_IO0_PA00
NetJ5_5: U1.L3(PA1) ; port FLEXCOM0_IO1_PA01
NetJ5_7: U1.C7(PB23) ; port I2SMCK_PB23
NetJ5_8: U1.N3(PA5) ; port FLEXCOM_TX_PA05
NetJ5_10: U1.N1(PA6) ; port FLEXCOM_RX_PA06
NetJ5_11: U1.K2(PA2) ; port GPIO_PA02
NetJ5_12: U1.A7(PB19) ; port I2SCK_PB19
NetJ5_13: U1.L1(PA4) ; port GPIO_PA04
NetJ5_15: U1.K3(PA3) ; port GPIO_PA03
NetJ5_16: U1.F4(PB7) ; port E0_TXEN_PB7
NetJ5_18: U1.D5(PB8) ; port E0_TXER_PB8
NetJ5_19: U1.G4(PA12) ; port SPI_MOSI_PA12
NetJ5_21: U1.G3(PA11) ; port SPI_MISO_PA11
NetJ5_22: U1.G2(PA14) ; port GPIO_PA14
NetJ5_23: U1.G1(PA13) ; port SPI_SCLK_PA13
NetJ5_24: U1.P2(PA7) ; port NPCS1_PA07
NetJ5_26: U1.P3(PA8) ; port NPCS2_PA08
NetJ5_29: U1.U13(PC31) ; port CLK1_PC31
NetJ5_31: U1.A5(PB13) ; port CLK2_PB13
NetJ5_32: U1.C5(PB11) ; port PWM0_PB11
NetJ5_33: U1.A2(PB12) ; port PWM1_PB12
NetJ5_35: U1.D9(PB20) ; port I2SWS_PB20
NetJ5_36: U1.B9(PB24) ; port GPIO_PB24
NetJ5_37: U1.D3(PB6) ; port E0_MDC_PB6
NetJ5_38: U1.A8(PB21) ; port I2SDIN_PB21
NetJ5_40: U1.B8(PB22) ; port I2SDOUT_PB22
NetJ6_2: U1.M4(PA10) ; port DBGU_TX_PA10
NetJ6_3: U1.N2(PA9) ; port DBGU_RX_PA09
NetR31_2: U1.E2(PB16) ; port USBA_VBUSDETECT_PB16
NetU1_H3: U1.H3(PA18) ; port SDMMC0_DAT1_PA18
NetU1_H4: U1.H4(PA17) ; port SDMMC0_CLK_PA17
NetU1_J1: U1.J1(PA19) ; port SDMMC0_DAT2_PA19
NetU1_J2: U1.J2(PA16) ; port SDMMC0_CMD_PA16
NetU1_J4: U1.J4(PA20) ; port SDMMC0_DAT3_PA20
NetU1_K1: U1.K1(PA15) ; port SDMMC0_DAT0_PA15

Not connected (* = marked no-connect by the designer): U1 A3(PB2) A4(PB17) A9(PA25) A10(PA22) A11(PA28) B3(PB0) B4(PB9) B5(PB10) B7(PB25) B10(PA24) B11(PA21) C4(PB15) C10(PA29) C17(PD6) D1(PB1) D2(PB3) D7(PB18) D10(PA26) D12(PA27) D16(PD8) D17(PD13) E1(PB5) E3(PB4) E4(PB14) E15(PD11) E16(PD12) E17(PD10) F14(PD14) G15(PD18) G16(PD19) G17(PD21) H1(PA30) H2(PA31) H14(PD15) H15(PD1) H16(PD16) H17(PD17) J14(PD9) J16(PD3) J17(PD4) K14(PD5) K15(PD20) K16(PD7) K17(PD2) L17(PD0) P5(PC25) P6(PC19) P8(PC21) P9(PC29) P13(PC28) R1(PC9) R2(PC7) R4(PC13) R5(PC4) R7(PC18) R8(PC17) R10(PC16) R13(PC26) R14(PC22) T1(PC3) T3(PC11) T4(PC2) T5(PC12) T7(PC6) T8(PC10) T9(PC23) T13(PC30) T14(PC20) U2(PC14) U3(PC1) U4(PC5) U5(PC15) U7(PC8) U8(PC0) U9(PC27) U14(PC24)

### Notes on the sheet
- (in symbol SAM9X60D1G-I/4FB, part D) SAM9X60 SIP Port PA (VDDIOP0)
- (in symbol SAM9X60D1G-I/4FB, part E) SAM9X60 SIP Port PB
- (in symbol SAM9X60D1G-I/4FB, part F) SAM9X60 SIP Port PC (VDDIOP1)
- (in symbol SAM9X60D1G-I/4FB, part G) SAM9X60 SIP; Port PD (VDDNF)
- (in symbol TitleBlock) Free to redistribute. Not for commercial use.; Project:; Variant:; Page Contents:; Size:; DWG NO:; Revision:; Date:; Sheet; Of

### Library data of the parts
*#3 = TitleBlock: Custom Title Block; DWG: -
U1 = SAM9X60D1G-I/4FB: as U1 on sheet Power; Supplier 1: Digi-Key; RoHS: No; Category: Microprocessors; Stock 1: 237; Pricing 1: 1=10.63000, 25=9.74040, 100=8.82060 (USD); Supplier Part Number 1: 150-SAM9X60D6K-I/4GB-ND

## Sheet USB.SchDoc
size A; DocumentNumber: 4; SheetNumber: 4; SheetTotal: 6
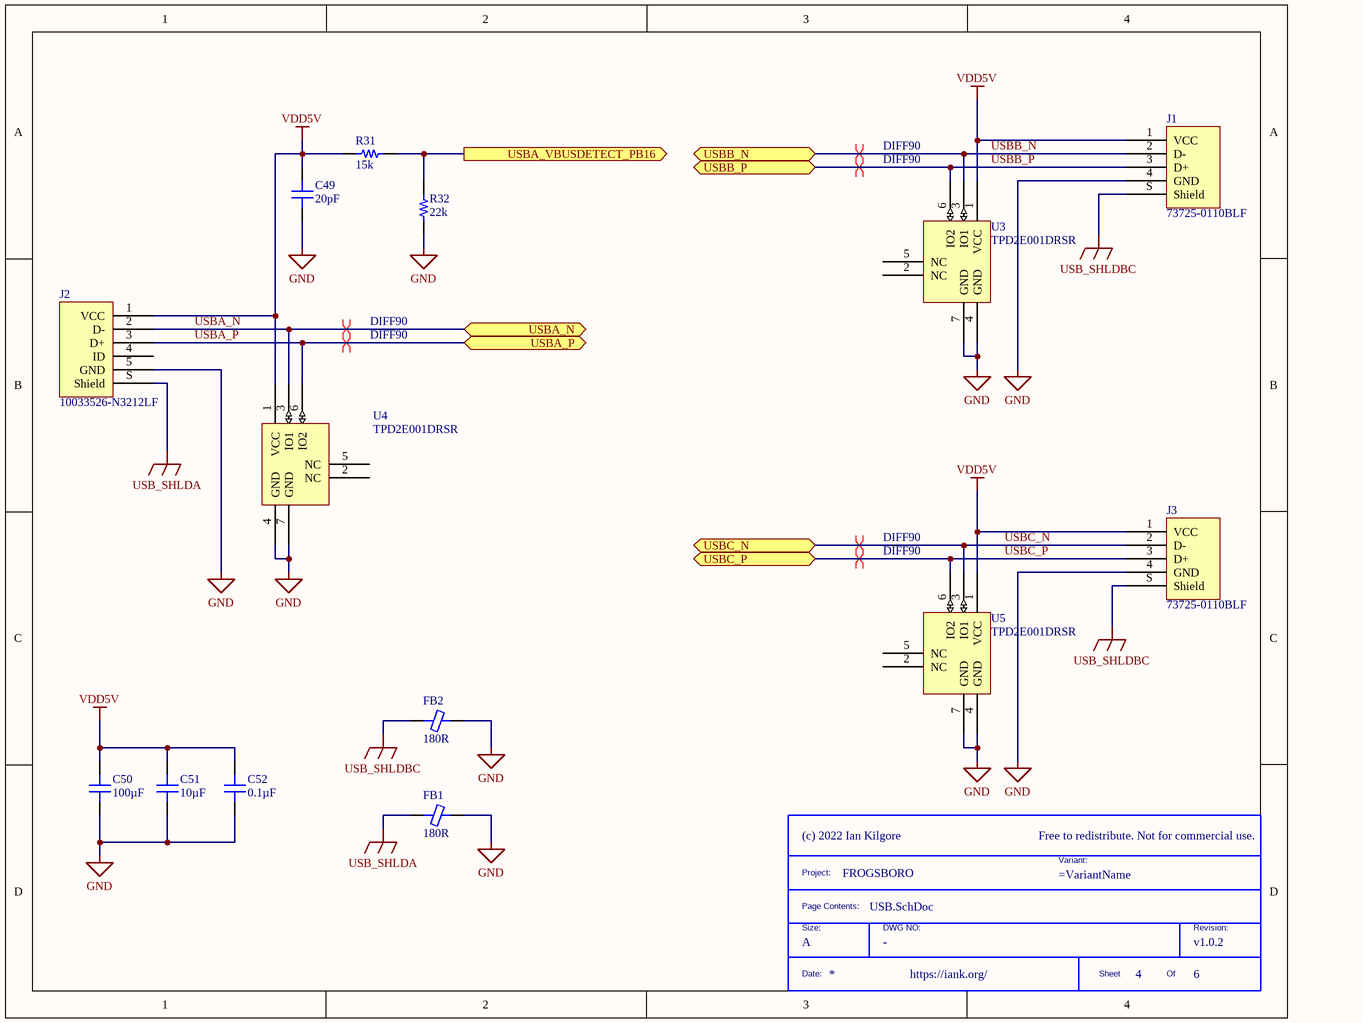
[diagram p3: USB.SchDoc]

### Parts
(Parts that share a designator on the sheet are numbered #1, #2 ... from top to bottom, then left to right.)
*#4  Size: A  (hidden comment: TitleBlock)  (graphical)
C49  20pF  [CAP 0402_1005]
C50  100µF  [CAP 1210_3225 - 2.8MM]
C51  10µF  [CAP 0805_2012]
C52  0.1µF  [CAP 0402_1005]
FB1  180R  [FER 0603_1608]
FB2  180R  [FER 0603_1608]
J1  73725-0110BLF  [AMPHENOL USB 73725-0110BLF]
J2  10033526-N3212LF  [FCI USB 10033526-N3212LF]
J3  73725-0110BLF  [AMPHENOL USB 73725-0110BLF]
R31  15k  [RES 0402_1005]
R32  22k  [RES 0402_1005]
U3  TPD2E001DRSR  [SON95P300X80_HS-7N]
U4  TPD2E001DRSR  [SON95P300X80_HS-7N]
U5  TPD2E001DRSR  [SON95P300X80_HS-7N]

### Ports
USBA_N (bidir), USBA_P (bidir), USBA_VBUSDETECT_PB16 (out), USBB_N (bidir), USBB_P (bidir), USBC_N (bidir), USBC_P (bidir)

### Nets
GND: C49.1 C50.1 C51.1 C52.2 FB1.1 FB2.1 J1.4(GND) J2.5(GND) J3.4(GND) R32.1 U3.4(GND) U3.7(GND) U4.4(GND) U4.7(GND) U5.4(GND) U5.7(GND)
USB_SHLDA: FB1.2 J2.S(Shield)
USB_SHLDBC: FB2.2 J1.S(Shield) J3.S(Shield)
VDD5V: C49.2 C50.2 C51.2 C52.1 J1.1(VCC) J2.1(VCC) J3.1(VCC) R31.1 U3.1(VCC) U4.1(VCC) U5.1(VCC)
USBA_N: J2.2(D-) U4.3(IO1) ; port USBA_N
USBA_P: J2.3(D+) U4.6(IO2) ; port USBA_P
USBB_N: J1.2(D-) U3.3(IO1) ; port USBB_N
USBB_P: J1.3(D+) U3.6(IO2) ; port USBB_P
USBC_N: J3.2(D-) U5.3(IO1) ; port USBC_N
USBC_P: J3.3(D+) U5.6(IO2) ; port USBC_P
NetR31_2: R31.2 R32.2 ; port USBA_VBUSDETECT_PB16

Not connected (* = marked no-connect by the designer): J2 4(ID); U3 2(NC) 5(NC); U4 2(NC) 5(NC); U5 2(NC) 5(NC)

### Layout directives
differential pair; differential pair class DIFF90: USBA_N, USBA_P, USBB_N, USBB_P, USBC_N, USBC_P

### Notes on the sheet
- (in symbol TitleBlock) Free to redistribute. Not for commercial use.; Project:; Variant:; Page Contents:; Size:; DWG NO:; Revision:; Date:; Sheet; Of

### Library data of the parts
*#4 = TitleBlock: Custom Title Block; DWG: -
C49 = GJM1555C1H200FB01D: as C46 on sheet SAM9X60_Core; Part Number: GJM1555C1H200FB01D; Value: 20pF; Applications: RF, Microwave, High Frequency; Capacitance: 20pF; ComponentLink1Description: Datasheet; ComponentLink1URL: https://search.murata.co.jp/Ceramy/image/img/A01X/G101/ENG/GJM1555C1H200FB01-01.pdf; ComponentLink2Description: DigiKey Link; ComponentLink2URL: http://digikey.com/product-detail/en/murata-electronics/GJM1555C1H200FB01D/490-11204-1-ND/5333044; Device Package: 0402 (1005 Metric); Features: High Q, Low Loss; LastUpdated: 9/2/2020 1:02:17 AM; Lifecycle Status: Active; Minimum Order: 1; Mounting Type: Surface Mount, MLCC; Operating Temperature: -55°C ~ 125°C; Package / Case: 0402 (1005 Metric); Packaging: TapeAndReel; PartId: 4905; Part Status: Active; Price: 0.04; Series: GJM; Size / Dimension: 0.039" L x 0.020" W (1.00mm x 0.50mm); Supplier 1: DigiKey; Supplier Part Number 1: 490-11204-1-ND; Thickness (Max): 0.022" (0.55mm); Voltage - Rated: 50V
C50 = LMK325ABJ107MMHP: CAP CER 100UF 10V X5R 1210; Manufacturer: Taiyo Yuden; Tolerance: ±20%; Part Number: LMK325ABJ107MMHP; Value: 100µF; Applications: Automotive; Capacitance: 100µF; ComponentLink1Description: Datasheet; ComponentLink1URL: https://ds.yuden.co.jp/TYCOMPAS/ut/detail?pn=LMK325ABJ107MMHP &u=M; ComponentLink2Description: DigiKey Link; ComponentLink2URL: http://digikey.com/product-detail/en/taiyo-yuden/LMK325ABJ107MMHP/587-5467-1-ND/7067143; Device Package: 1210 (3225 Metric); LastUpdated: 9/2/2020 1:10:52 AM; Lifecycle Status: Active; Minimum Order: 1; Mounting Type: Surface Mount, MLCC; Operating Temperature: -55°C ~ 85°C; Package / Case: 1210 (3225 Metric); Packaging: TapeAndReel; PartId: 23688; Part Status: Active; Price: 0.49; Series: M; Size / Dimension: 0.126" L x 0.098" W (3.20mm x 2.50mm); Supplier 1: DigiKey; Supplier Part Number 1: 587-5467-1-ND; Temperature Coefficient: X5R; Thickness (Max): 0.110" (2.80mm); Voltage - Rated: 10V
C51 = CL21A106KPCLQNC: as C23 on sheet Power; Part Number: CL21A106KPCLQNC; Value: 10µF; Applications: General Purpose; Capacitance: 10µF; ComponentLink1Description: Datasheet; ComponentLink1URL: http://www.samsungsem.com/kr/support/product-search/mlcc/CL21A106KPCLQNC.jsp; ComponentLink2Description: DigiKey Link; ComponentLink2URL: http://digikey.com/product-detail/en/samsung-electro-mechanics/CL21A106KPCLQNC/1276-2402-1-ND/3890488; Device Package: 0805 (2012 Metric); LastUpdated: 9/2/2020 1:04:19 AM; Lifecycle Status: Active; Minimum Order: 1; Mounting Type: Surface Mount, MLCC; Operating Temperature: -55°C ~ 85°C; Package / Case: 0805 (2012 Metric); Packaging: TapeAndReel; PartId: 14319; Part Status: Active; Price: 0.03; Series: CL; Size / Dimension: 0.079" L x 0.049" W (2.00mm x 1.25mm); Supplier 1: DigiKey; Supplier Part Number 1: 1276-2402-1-ND; Temperature Coefficient: X5R; Thickness (Max): 0.037" (0.95mm); Voltage - Rated: 10V
C52 = C0402C104K4PACTU: as C2 on sheet Power; Part Number: C0402C104K4PACTU; Value: 0.1µF; Applications: General Purpose; Capacitance: 0.1µF; ComponentLink1Description: Datasheet; ComponentLink1URL: https://api.kemet.com/component-edge/download/datasheet/C0402C104K4PACTU.pdf; ComponentLink2Description: DigiKey Link; ComponentLink2URL: http://digikey.com/product-detail/en/kemet/C0402C104K4PACTU/399-7762-1-ND/3471485; Device Package: 0402 (1005 Metric); LastUpdated: 9/2/2020 1:02:03 AM; Lifecycle Status: Active; Minimum Order: 1; Mounting Type: Surface Mount, MLCC; Operating Temperature: -55°C ~ 85°C; Package / Case: 0402 (1005 Metric); Packaging: TapeAndReel; PartId: 11334; Part Status: Active; Price: 0.01; Series: SMD Comm X5R; Size / Dimension: 0.039" L x 0.020" W (1.00mm x 0.50mm); Supplier 1: DigiKey; Supplier Part Number 1: 399-7762-1-ND; Temperature Coefficient: X5R; Thickness (Max): 0.022" (0.55mm); Voltage - Rated: 16V
FB1 FB2 = MPZ1608S181ATAH0: FERRITE BEAD 180 OHM 0603 1LN; Manufacturer: TDK Corporation; Current Rating (Max): 2A; DC Resistance (DCR) (Max): 50mOhm; Filter Type: Power Line; Impedance @ Frequency: 180 Ohms @ 100MHz; Number of Lines: 1; Part Number: MPZ1608S181ATAH0; ComponentLink1Description: Datasheet; ComponentLink1URL: https://product.tdk.com/info/en/catalog/datasheets/beads_commercial_power_mpz1608_en.pdf?ref_disty=digikey; ComponentLink2Description: DigiKey Link; ComponentLink2URL: http://digikey.com/product-detail/en/tdk-corporation/MPZ1608S181ATAH0/445-5220-1-ND/2117954; Device Package: 0603 (1608 Metric); Height (Max): 0.030" (0.75mm); LastUpdated: 9/2/2020 1:18:17 AM; Lifecycle Status: Active; Minimum Order: 1; Mounting Type: Surface Mount; Operating Temperature: -55°C ~ 125°C; Package / Case: 0603 (1608 Metric); Packaging: TapeAndReel; PartId: 1025; Part Status: Active; Price: 0.02; Series: MPZ; Size / Dimension: 0.063" L x 0.032" W (1.60mm x 0.80mm); Supplier 1: DigiKey; Supplier Part Number 1: 445-5220-1-ND; Value: 180R
J1 J3 = 73725-0110BLF: CONN RCPT USB2.0 TYPEA 4POS R/A; Manufacturer: Amphenol ICC (FCI); Connector Type: USB - A; Current Rating (Amps): 2.5A; Gender: Receptacle; Mating Cycles: 1500; Number of Contacts: 4; Number of Ports: 1; Shielding: Shielded; Part Number: 73725-0110BLF; ComponentLink1Description: Datasheet; ComponentLink1URL: http://www.amphenol-icc.com/media/wysiwyg/files/drawing/73725.pdf; ComponentLink2Description: DigiKey Link; ComponentLink2URL: http://digikey.com/product-detail/en/amphenol-icc-fci/73725-0110BLF/609-1041-ND/1001355; Features: Board Lock; LastUpdated: 4/30/2020 11:56:05 AM; Lifecycle Status: Active; Minimum Order: 1; Mounting Feature: Vertical; Mounting Type: Through Hole, Right Angle; Operating Temperature: -55°C ~ 85°C; Packaging: Tube; Part Status: Active; Price: 0.91; Series: 73725; Specifications: USB 2.0; Supplier 1: DigiKey; Supplier Part Number 1: 609-1041-ND; Termination: Solder
J2 = 10033526-N3212LF: CONN RCPT MINI USB B 5POS SMD RA; Manufacturer: Amphenol ICC (FCI); Connector Type: USB - mini B; Current Rating (Amps): 1A per Contact; Gender: Receptacle; Mating Cycles: 5000; Number of Contacts: 5; Number of Ports: 1; Shielding: Shielded; Voltage - Rated: 30V; Part Number: 10033526-N3212LF; ComponentLink1Description: Datasheet; ComponentLink1URL: http://www.amphenol-icc.com/media/wysiwyg/files/drawing/10033526.pdf; ComponentLink2Description: DigiKey Link; ComponentLink2URL: //digikey.com/product-detail/en/amphenol-icc-fci/10033526-N3212LF/609-4700-2-ND/4292074; Features: Board Guide, Solder Retention; LastUpdated: 12/9/2019 8:52:14 PM; Lifecycle Status: 0; Minimum Order: 1; Mounting Feature: Horizontal; Mounting Type: Surface Mount, Right Angle; Operating Temperature: -25°C ~ 85°C; Packaging: TapeAndReel; Part Status: Active; Price: 0.39; Series: -; Supplier 1: DigiKey; Supplier Part Number 1: 609-4700-2-ND; Termination: Solder
R31 = ERJ-PA2F1502X: RES SMD 15K OHM 1% 1/5W 0402; Manufacturer: Panasonic Electronic Components; Power (Watts): 0.2W, 1/5W; Resistance: 15 kOhms; Temperature Coefficient: ±100ppm/°C; Part Number: ERJ-PA2F1502X; Value: 15k; ComponentLink1Description: Datasheet; ComponentLink1URL: https://industrial.panasonic.com/cdbs/www-data/pdf/RDO0000/AOA0000C331.pdf; ComponentLink2Description: DigiKey Link; ComponentLink2URL: http://digikey.com/product-detail/en/panasonic-electronic-components/ERJ-PA2F1502X/P17231CT-ND/5402719; Composition: Thick Film; Device Package: 0402 (1005 Metric); Features: Automotive AEC-Q200, Pulse Withstanding; Height - Seated (Max): 0.016" (0.40mm); LastUpdated: 9/2/2020 1:07:58 AM; Lifecycle Status: Active; Minimum Order: 1; Number of Terminations: 2; Operating Temperature: -55°C ~ 155°C; Package / Case: 0402 (1005 Metric); Packaging: TapeAndReel; PartId: 7876; Part Status: Active; Price: 0.02; Ratings: AEC-Q200; Series: ERJ; Size / Dimension: 0.039" L x 0.020" W (1.00mm x 0.50mm); Supplier 1: DigiKey; Supplier Part Number 1: P17231CT-ND; Supplier Device Package: 0402; Tolerance: ±1%
R32 = CR0402-FX-2202GLF: as R3 on sheet Power; Part Number: CR0402-FX-2202GLF; Value: 22k; ComponentLink1Description: Datasheet; ComponentLink1URL: https://www.bourns.com/docs/Product-Datasheets/CR0402.pdf; ComponentLink2Description: DigiKey Link; ComponentLink2URL: http://digikey.com/product-detail/en/bourns-inc/CR0402-FX-2202GLF/CR0402-FX-2202GLFCT-ND/4247665; Composition: Thick Film; Device Package: 0402 (1005 Metric); Height - Seated (Max): 0.016" (0.40mm); LastUpdated: 9/2/2020 1:08:01 AM; Lifecycle Status: Active; Minimum Order: 1; Number of Terminations: 2; Operating Temperature: -55°C ~ 155°C; Package / Case: 0402 (1005 Metric); Packaging: CutTape; PartId: 6638; Part Status: Active; Price: 0.10; Series: CR0402; Size / Dimension: 0.039" L x 0.020" W (1.00mm x 0.50mm); Supplier 1: DigiKey; Supplier Part Number 1: CR0402-FX-2202GLFCT-ND; Supplier Device Package: 0402; Tolerance: ±1%
U3-U5 = TPD2E001DRSR: Dual 1.5-pF, 5.5-V, ±8-kV ESD protection diode with 1-nA max leakage & VCC pin for USB 2.0 6-SON -40 to 85; Manufacturer: Texas Instruments; Direction: Unidirectional; Operating Supply Voltage: 5.5V; Number of Channels: 2; Capacitance: 1.5pF; Min Breakdown Voltage: 11V; Power Line Protection: Yes; Clamping Voltage: 105.5V; Max Reverse Leakage Current: 1nA; Test Current: 10mA; Interface: LVDS,USB,Ethernet; Supplier 1: Arrow Electronics; Manufacturer Part Number: TPD2E001DRSR; RoHS: Yes; Category: Interface ICs; Stock 1: 1000; Pricing 1: 1=0.61530, 10=0.52960, 25=0.52440, 100=0.39900, 250=0.39500, 500=0.27490, 1000=0.24620, 1000=0.21900, 2000=0.21460 (USD); Number of Pins: 6; Contact Plating: Gold; Min Operating Temperature: -40°C; Max Operating Temperature: 85°C; Packaging: Tape and Reel; Package Quantity: 1; Number of Bidirectional Channels: 2; Reverse Standoff Voltage: 5.5V; Termination: SMD/SMT; ESD Protection: Yes; Leakage Current: 1nA; Element Configuration: Dual; Length: 3mm; Width: 1.3mm; Height: 0.55mm; Depth: 3mm; Radiation Hardening: No; REACH SVHC: No SVHC; Lead Free: Lead Free; RoHS Compliant: Yes; ComponentLink1URL: https://datasheet.ciiva.com/15134/getdatasheetpartid-321682-15134763.pdf?src-supplier=Verical; ComponentLink1Description: https://datasheet.ciiva.com/15134/getdatasheetpartid-321682-15134763.pdf?src-supplier=Verical; ComponentLink2URL: https://datasheet.ciiva.com/1268/1851973-1268376.pdf?src-supplier=Element14; ComponentLink2Description: https://datasheet.ciiva.com/1268/1851973-1268376.pdf?src-supplier=Element14; ComponentLink3URL: https://datasheet.ciiva.com/339/tpd2e001-339042.pdf?src-supplier=Digi-Key; ComponentLink3Description: https://datasheet.ciiva.com/339/tpd2e001-339042.pdf?src-supplier=Digi-Key; ComponentLink4URL: https://datasheet.ciiva.com/339/tpd2e001-339041.pdf?src-supplier=Digi-Key; ComponentLink4Description: https://datasheet.ciiva.com/339/tpd2e001-339041.pdf?src-supplier=Digi-Key; ComponentLink5URL: https://datasheet.ciiva.com/339/tpd2e001-339043.pdf?src-supplier=Digi-Key; ComponentLink5Description: https://datasheet.ciiva.com/339/tpd2e001-339043.pdf?src-supplier=Digi-Key; ComponentLink6URL: https://datasheet.ciiva.com/25955/tpd2e001-25955452.pdf?src-supplier=Avnet+Europe; ComponentLink6Description: https://datasheet.ciiva.com/25955/tpd2e001-25955452.pdf?src-supplier=Avnet+Europe; Supplier Part Number 1: TPD2E001DRSR